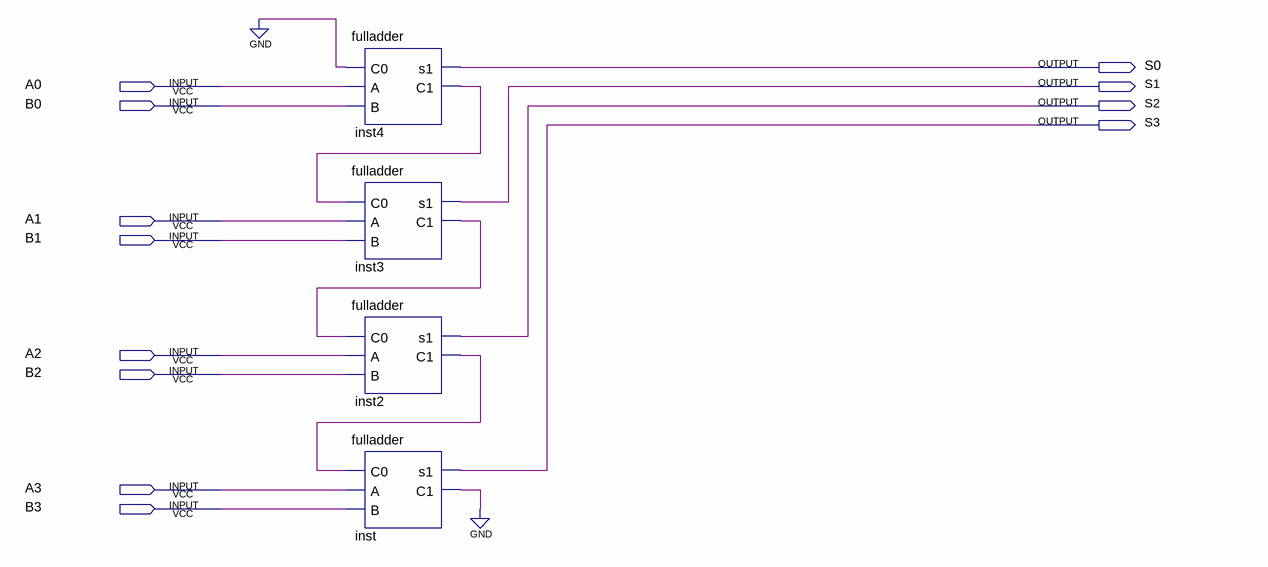
[diagram p0: schematic sheet]
// Quartus schematic sum4.bdf as structural Verilog: 4 symbols, 12 pins
module sum4 (
  input  A0,
  input  B0,
  input  A1,
  input  B1,
  input  A2,
  input  B2,
  input  A3,
  input  B3,
  output S0,
  output S1,
  output S2,
  output S3
);

  wire inst2_c1, inst3_c1, inst4_c1, inst_c1;

  fulladder inst4 (.C0(1'b0), .A(A0), .B(B0), .s1(S0), .C1(inst4_c1));
  fulladder inst3 (.C0(inst4_c1), .A(A1), .B(B1), .s1(S1), .C1(inst3_c1));
  fulladder inst2 (.C0(inst3_c1), .A(A2), .B(B2), .s1(S2), .C1(inst2_c1));
  fulladder inst (.C0(inst2_c1), .A(A3), .B(B3), .s1(S3), .C1(inst_c1));
  // also tied to GND on the sheet: inst_c1
endmodule
